# Altium schematic sheet VCC.SchDoc
size A4
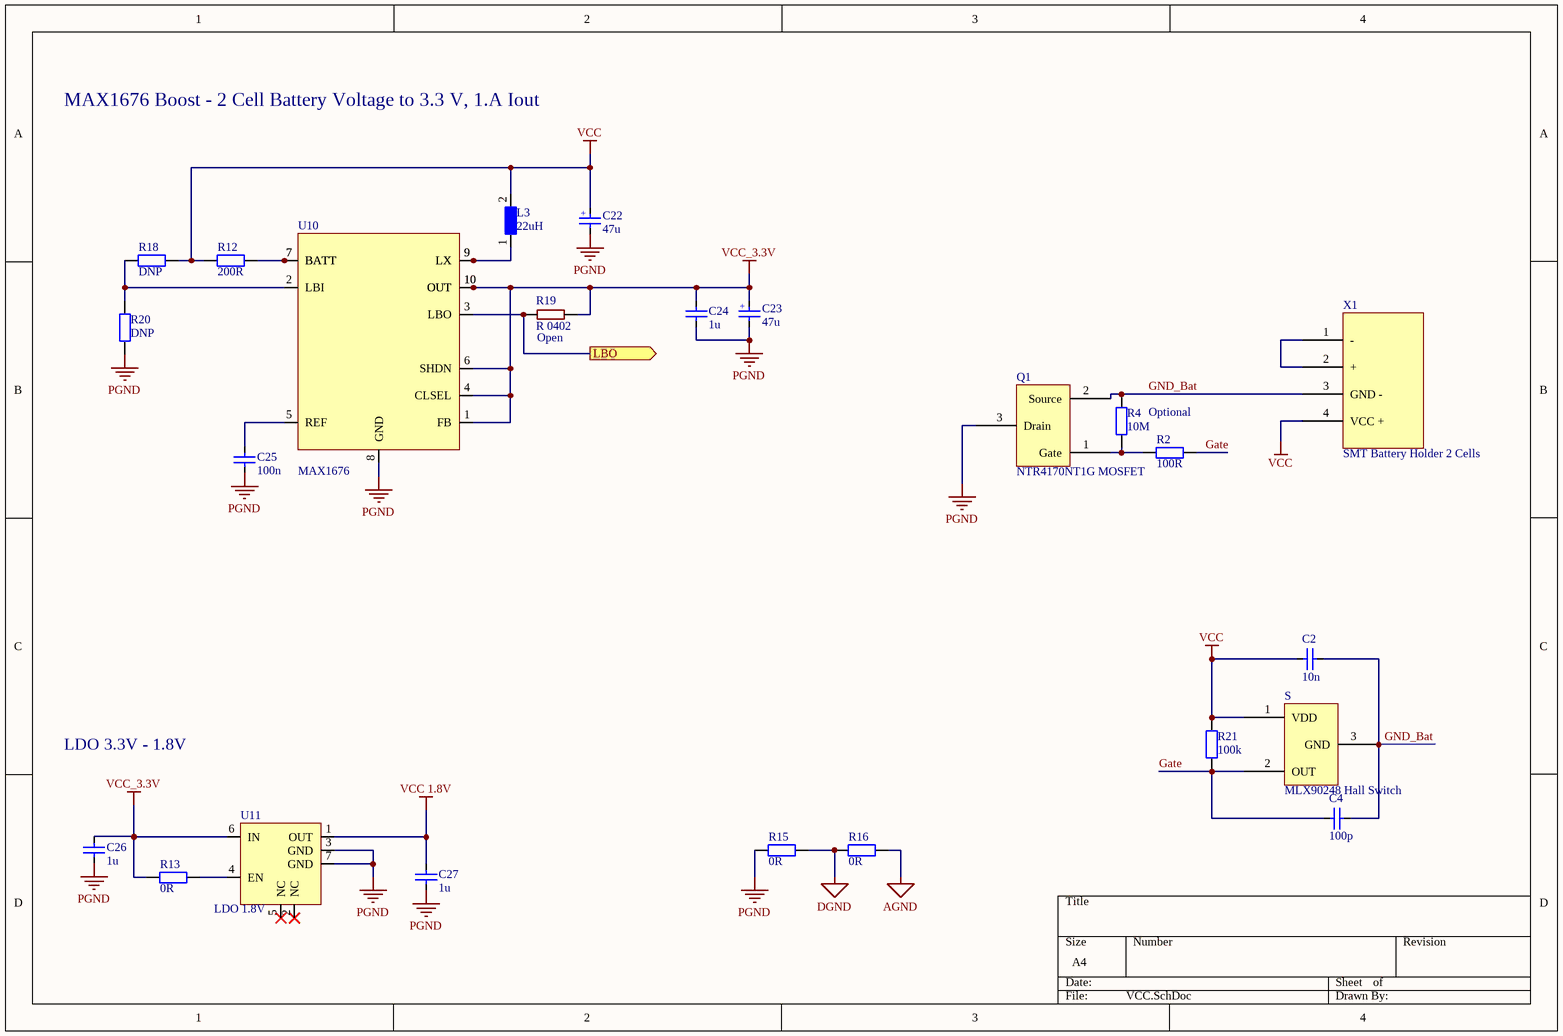
[diagram p0: VCC.SchDoc]

## Parts
C2  10n  [CAPC1005X03N]
C4  100p  [CAPC1005X03N]
C22  47u  [AVX TPSC476M016R0350]
C23  47u  [AVX TPSD107M010R0100 100uF]
C24  1u  [CAPC1608X05N]
C25  100n  [CAPC1608X05N]
C26  1u  [CAPC1608X05N]
C27  1u  [CAPC1608X05N]
L3  22uH  [CD54-220]
Q1  NTR4170NT1G MOSFET  [NTR4170NT1G]
R2  100R  [RESC1005X03N]
R4  10M  [RESC1608X05N]
R12  200R  [RESC1608X05N]
R13  0R  [RESC1608X05N]
R15  0R  [RESC2012X05N]
R16  0R  [RESC2012X05N]
R18  DNP  [RESC1005X03N]
R19  R 0402  [R 0402]
R20  DNP  [RESC1005X03N]
R21  100k  [RESC1005X03N]
S  MLX90248 Hall Switch  [MLX90248]
U10  MAX1676  [MAX1676-Boost]
U11  LDO 1.8V  [TLV75518PDRVR]
X1  SMT Battery Holder 2 Cells  [SMT Battery Holder]

## Ports
LBO (out)

## Nets
AGND: R16.2
DGND: R15.2 R16.1
PGND: C22.2 C23.2 C24.1 C25.2 C26.1 C27.1 Q1.3(Drain) R15.1 R20.1 U10.8(GND) U11.3(GND) U11.7(GND)
VCC: C2.2 C22.1 L3.2 R12.1 R18.2 R21.2 S.1(VDD) X1.4(VCC_+)
VCC 1.8V: C27.2 U11.1(OUT)
VCC_3.3V: C23.1 C24.2 C26.2 R13.1 R19.2 U10.1(FB) U10.4(CLSEL) U10.6(SHDN) U10.10(OUT) U11.6(IN)
Gate: C4.1 R2.1 R21.1 S.2(OUT)
GND_Bat: C2.1 C4.2 Q1.2(Source) R4.2 S.3(GND) X1.3(GND_-)
LBO: R19.1 U10.3(LBO) ; port LBO
NetC25_1: C25.1 U10.5(REF)
NetL3_1: L3.1 U10.9(LX)
NetQ1_1: Q1.1(Gate) R2.2 R4.1
NetR12_2: R12.2 U10.7(BATT)
NetR13_2: R13.2 U11.4(EN)
NetR18_1: R18.1 R20.2 U10.2(LBI)
NetX1_1: X1.1(-) X1.2(+)

Not connected (* = marked no-connect by the designer): U11 2(NC)* 5(NC)*

## Notes on the sheet
- MAX1676 Boost - 2 Cell Battery Voltage to 3.3 V, 1.A Iout
- (near R19) Open
- Optional
- LDO 3.3V - 1.8V
- (in symbol C_47u_16V_2312) +
- (in symbol C_100u_10V_2917) +

## Library data of the parts
C2 = C_10n_50V_0402: Kondensator 10n 50V 0402; Tested: False; Supplier 1: Farnell; Supplier Part Number 1: 1828887
C4 = C_100p_50V_0402: Kondensator 100p 50V 0402; Tested: False; Supplier 1: Farnell
C22 = C_47u_16V_2312: Kondensator 47u 16V Tanatalum Capacitor; Cart: https://www.mouser.de/ProductDetail/AVX/TPSC476M016R0350?qs=%2Fha2pyFaduhj%252BASDCSGgk2azjUMSnKvo3TkO6PkyHka4p8K%2FssSCRw%3D%3D; Datasheet: https://www.mouser.de/datasheet/2/40/tps-776850.pdf
C23 = C_100u_10V_2917: Kondensator 100u 10V Tanatalum Capacitor; Cart: https://www.mouser.de/ProductDetail/AVX/TPSC476M016R0350?qs=%2Fha2pyFaduhj%252BASDCSGgk2azjUMSnKvo3TkO6PkyHka4p8K%2FssSCRw%3D%3D; Datasheet: https://www.mouser.de/datasheet/2/40/tps-776850.pdf
C24 C26 C27 = C_1u_25V_0603: Kondensator 1u 25V X7R 0603; Tested: False; Supplier 1: Farnell; Supplier Part Number 1: 2495176
C25 = C_100n_50V_0603: Kondensator 100n 50V 0603; Supplier 1: Farnell; Supplier Part Number 1: 1759122
L3 = L_22uH_CD54-220: 22uH power inductor (1.1 A) Sumida CD54-220; Cart: https://www.digikey.de/product-detail/de/sumida-america-components-inc/CD54NP-220MC/308-2271-1-ND/4356341; Datasheet: http://products.sumida.com/products/pdf/CD54.pdf
Q1 = NTR4170NT1G MOSFET: NTR4170NT1G MOSFET 30V 3.9A
R2 = R_100R_0402: Widerstand 100R 1% 0402; Tested: False; Supplier 1: Farnell; Supplier Part Number 1: 9239111
R4 = R_10M_0603: Widerstand 10M 1% 100mW 75V 0603; Tested: False; Supplier 1: Mouser; Supplier Part Number 1: 660-RK73H1JTTD1005F
R12 = R_200R_0603: Widerstand 200R 1% 100mW 50V 0603; Tested: False; Supplier 1: Farnell; Supplier Part Number 1: 2447292
R13 = R_0R_0603: Widerstand 0R 0603; Tested: False; Supplier 1: Farnell; Supplier Part Number 1: 2059527
R15 R16 = R_0R_0805: Widerstand 0R 0805; Tested: False; Supplier 1: Farnell; Supplier Part Number 1: 2057661
R18 R20 = R_0R_0402: Widerstand 0R 0402; Tested: True; Supplier 1: Farnell; Supplier Part Number 1: 2059190
R21 = R_10k_0402: Widerstand 100k 1% 0402; Tested: False; Supplier 1: Farnell; Supplier Part Number 1: 1358069
U10 = MAX1676: Boost, Step-Up DC-DC Converter
U11 = LDO_1.8V_TLV75518PDRVR
X1 = SMT Battery Holder 2 Cells: SMT Battery Holder, Keystone Electronics, 2 Cells AAA; Cart: https://www.digikey.de/product-detail/de/keystone-electronics/1022/36-1022-ND/2137859; Datasheet: https://www.keyelco.com/userAssets/file/M65p23.pdf